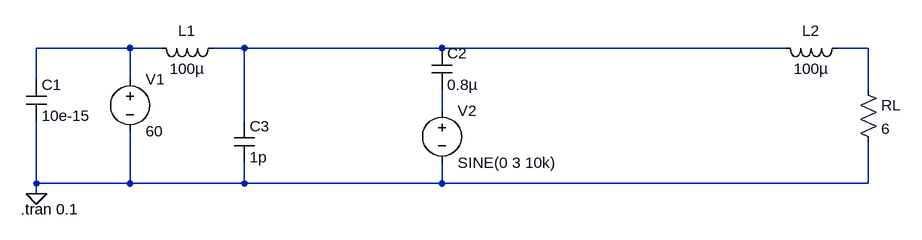
[diagram p0: schematic sensor.asc]
sensor.asc, the LTspice schematic file:
Version 4
SHEET 1 1340 680
WIRE 144 80 0 80
WIRE 192 80 144 80
WIRE 320 80 272 80
WIRE 624 80 320 80
WIRE 1152 80 624 80
WIRE 1280 80 1232 80
WIRE 0 128 0 80
WIRE 144 128 144 80
WIRE 1280 144 1280 80
WIRE 624 176 624 144
WIRE 320 192 320 80
WIRE 0 288 0 192
WIRE 144 288 144 208
WIRE 144 288 0 288
WIRE 320 288 320 256
WIRE 320 288 144 288
WIRE 624 288 624 256
WIRE 624 288 320 288
WIRE 1280 288 1280 224
WIRE 1280 288 624 288
WIRE 0 304 0 288
FLAG 0 304 0
SYMBOL voltage 624 160 R0
WINDOW 123 0 0 Left 2
WINDOW 39 24 124 Left 2
SYMATTR InstName V2
SYMATTR Value SINE(0 3 10k)
SYMBOL cap -16 128 R0
SYMATTR InstName C1
SYMATTR Value 10e-15
SYMBOL cap 608 80 R0
SYMATTR InstName C2
SYMATTR Value 0.8µ
SYMBOL voltage 144 112 R0
WINDOW 123 0 0 Left 2
WINDOW 39 24 124 Left 2
SYMATTR InstName V1
SYMATTR Value 60
SYMBOL ind 288 64 R90
WINDOW 0 5 56 VBottom 2
WINDOW 3 32 56 VTop 2
SYMATTR InstName L1
SYMATTR Value 100µ
SYMBOL res 1264 128 R0
SYMATTR InstName RL
SYMATTR Value 6
SYMBOL ind 1248 64 R90
WINDOW 0 5 56 VBottom 2
WINDOW 3 32 56 VTop 2
SYMATTR InstName L2
SYMATTR Value 100µ
SYMBOL cap 304 192 R0
SYMATTR InstName C3
SYMATTR Value 1p
TEXT -24 328 Left 2 !.tran 0.1

The netlist it stands for:
* sensor.asc
V2 N004 0 SINE(0 3 10k)
C1 N001 0 10e-15
C2 N002 N004 0.8µ
V1 N001 0 60
L1 N002 N001 100µ
RL N003 0 6
L2 N003 N002 100µ
C3 N002 0 1p
.tran 0.1
.backanno
.end